# Altium schematic sheet 15_SOLEDNOID.SchDoc
size 420 x 297 mm; SheetNumber: 23; SheetTotal: 24
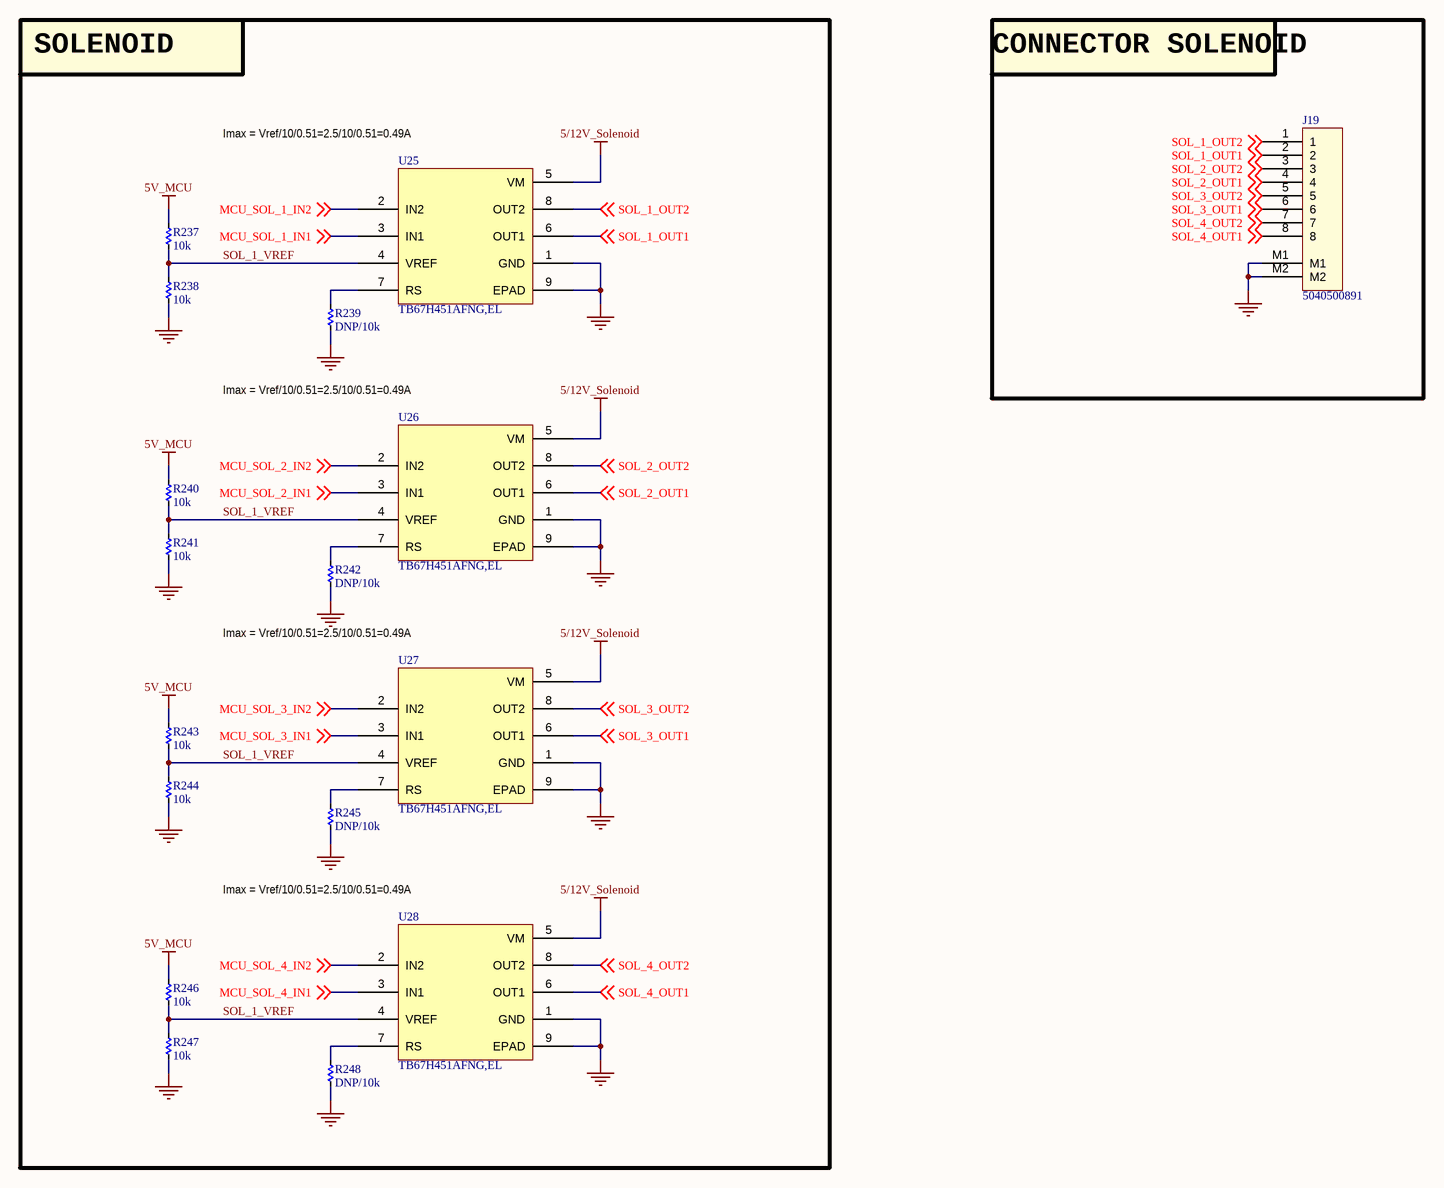
[diagram p0: 15_SOLEDNOID.SchDoc]

## Parts
J19  5040500891  [MOLEX_5040500891]
R237  10k  [RES_C_1005X40]
R238  10k  [RES_C_1005X40]
R239  DNP/10k  [RES_C_1005X40]
R240  10k  [RES_C_1005X40]
R241  10k  [RES_C_1005X40]
R242  DNP/10k  [RES_C_1005X40]
R243  10k  [RES_C_1005X40]
R244  10k  [RES_C_1005X40]
R245  DNP/10k  [RES_C_1005X40]
R246  10k  [RES_C_1005X40]
R247  10k  [RES_C_1005X40]
R248  DNP/10k  [RES_C_1005X40]
U25  TB67H451AFNG,EL
U26  TB67H451AFNG,EL
U27  TB67H451AFNG,EL
U28  TB67H451AFNG,EL

## Blocks framed on the sheet
SOLENOID: R237-R248 U25-U28
CONNECTOR SOLENOID: J19

## Nets
5/12V_Solenoid: U25.5(VM) U26.5(VM) U27.5(VM) U28.5(VM)
5V_MCU: R237.1 R240.1 R243.1 R246.1
GND: J19.M1 J19.M2 R238.2 R239.2 R241.2 R242.2 R244.2 R245.2 R247.2 R248.2 U25.1(GND) U25.9(EPAD) U26.1(GND) U26.9(EPAD) U27.1(GND) U27.9(EPAD) U28.1(GND) U28.9(EPAD)
MCU_SOL_1_IN1: U25.3(IN1) ; off-sheet MCU_SOL_1_IN1
MCU_SOL_1_IN2: U25.2(IN2) ; off-sheet MCU_SOL_1_IN2
MCU_SOL_2_IN1: U26.3(IN1) ; off-sheet MCU_SOL_2_IN1
MCU_SOL_2_IN2: U26.2(IN2) ; off-sheet MCU_SOL_2_IN2
MCU_SOL_3_IN1: U27.3(IN1) ; off-sheet MCU_SOL_3_IN1
MCU_SOL_3_IN2: U27.2(IN2) ; off-sheet MCU_SOL_3_IN2
MCU_SOL_4_IN1: U28.3(IN1) ; off-sheet MCU_SOL_4_IN1
MCU_SOL_4_IN2: U28.2(IN2) ; off-sheet MCU_SOL_4_IN2
SOL_1_OUT1: J19.2 U25.6(OUT1) ; off-sheet SOL_1_OUT1
SOL_1_OUT2: J19.1 U25.8(OUT2) ; off-sheet SOL_1_OUT2
SOL_1_VREF: R237.2 R238.1 R240.2 R241.1 R243.2 R244.1 R246.2 R247.1 U25.4(VREF) U26.4(VREF) U27.4(VREF) U28.4(VREF)
SOL_2_OUT1: J19.4 U26.6(OUT1) ; off-sheet SOL_2_OUT1
SOL_2_OUT2: J19.3 U26.8(OUT2) ; off-sheet SOL_2_OUT2
SOL_3_OUT1: J19.6 U27.6(OUT1) ; off-sheet SOL_3_OUT1
SOL_3_OUT2: J19.5 U27.8(OUT2) ; off-sheet SOL_3_OUT2
SOL_4_OUT1: J19.8 U28.6(OUT1) ; off-sheet SOL_4_OUT1
SOL_4_OUT2: J19.7 U28.8(OUT2) ; off-sheet SOL_4_OUT2
NetR239_1: R239.1 U25.7(RS)
NetR242_1: R242.1 U26.7(RS)
NetR245_1: R245.1 U27.7(RS)
NetR248_1: R248.1 U28.7(RS)

## Notes on the sheet
- (near U25) Imax = Vref/10/0.51=2.5/10/0.51=0.49A
- Imax = Vref/10/0.51=2.5/10/0.51=0.49A
- Project:
- BEE-PC1
- Sub-system:
- NANORACK_EXP_CONTROLLER
- Design by:
- SANG HUYNH
- BAO BUI Q.
- Sheet title:
- Sheet
- A3
- of
- Checked by:
- Approved by:
- VU PHAM
- Revision:
- Document No:
- V1.2.2
- Size:
- Date:

## Library data of the parts
J19 = Header 8x1_2M
R237-R248 = _RES_B_2: RES
U25-U28 = IC_H_bridge_TB67H451AFNG,EL: BRUSHED MOTOR DRIVER IC, 50V, 3.